# Altium schematic sheet COMM.SchDoc
size 594 x 420 mm; SheetNumber: 3; SheetTotal: 4
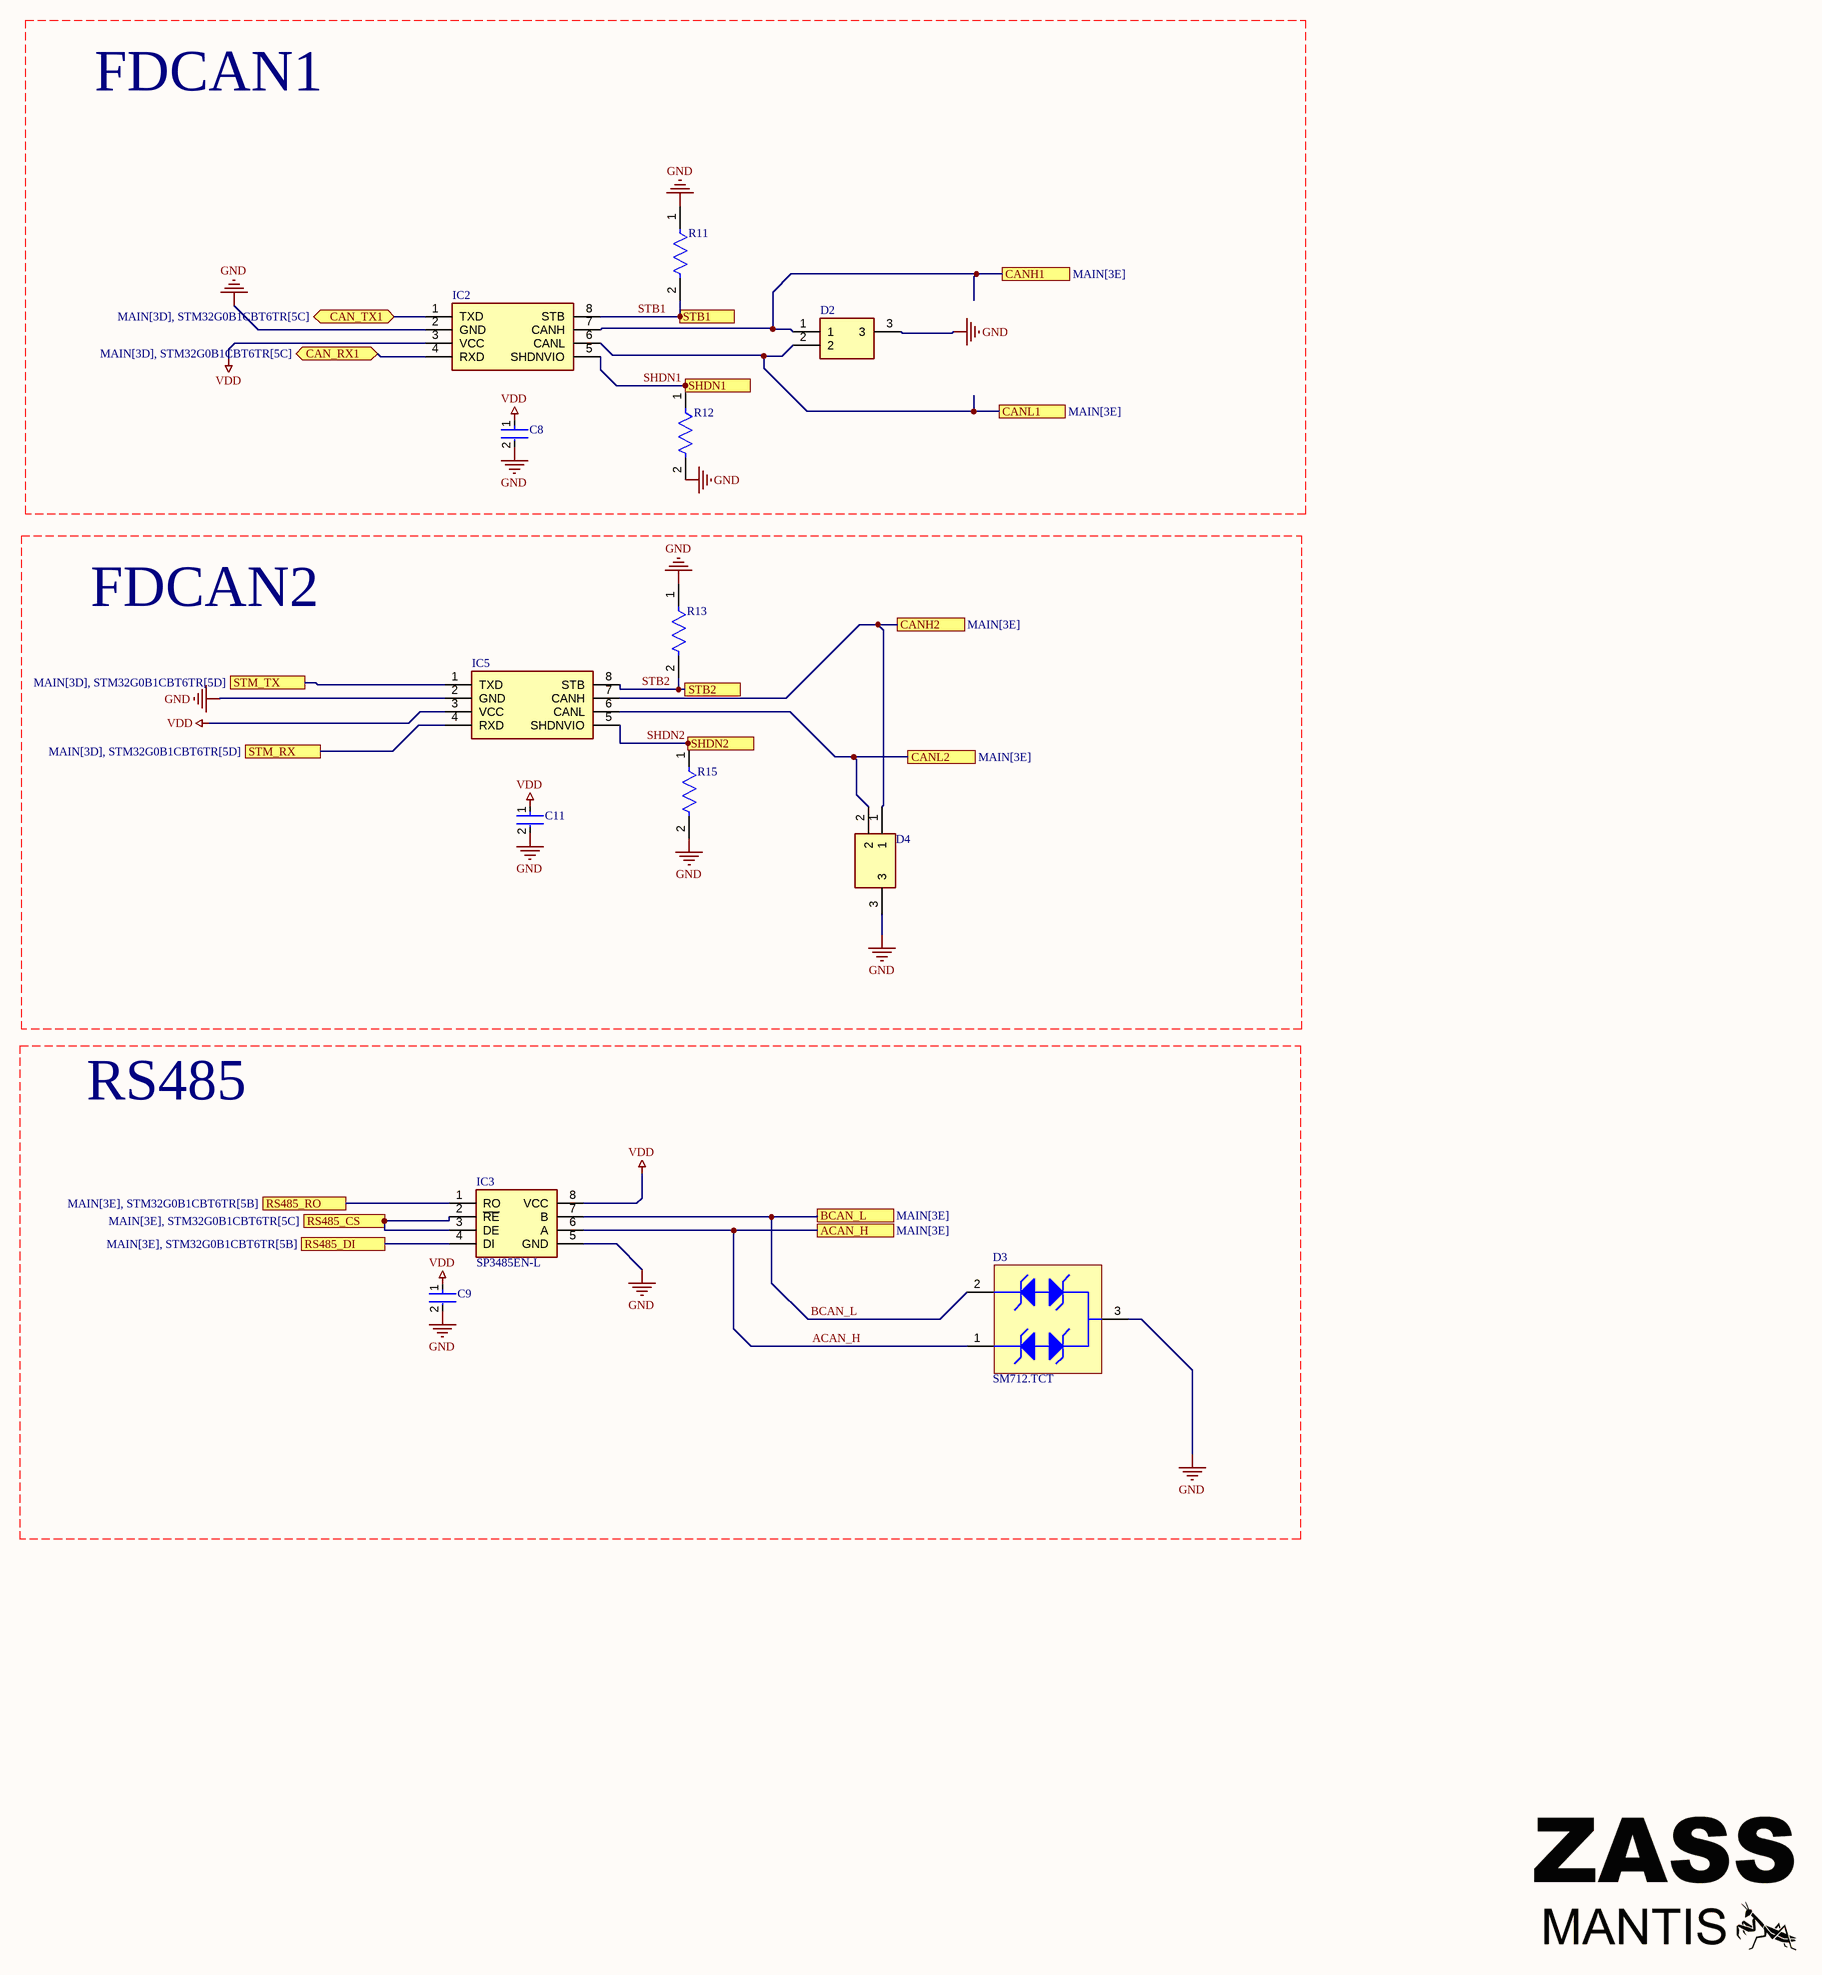
[diagram p0: COMM.SchDoc]

## Parts
C8  CC0805KRX7R5BB104  [FP-CC0805-EA-MFG]  (value not drawn)
C9  CC0805KRX7R5BB104  [FP-CC0805-EA-MFG]  (value not drawn)
C11  CC0805KRX7R5BB104  [FP-CC0805-EA-MFG]  (value not drawn)
D2  ESDCAN06-2BWY  [SOT65P210X110-3N]  (value not drawn)
D3  SM712.TCT  [SMTC-SOT23-3_V]
D4  ESDCAN06-2BWY  [SOT65P210X110-3N]  (value not drawn)
IC2  TCAN3414DR  [SOIC127P600X175-8N]  (value not drawn)
IC3  SP3485EN-L  [SOIC127P600X175-8N]
IC5  TCAN3414DR  [SOIC127P600X175-8N]  (value not drawn)
R11  CRGCQ0603J10K  [FP-CRGCQ0603-IPC_C]  (value not drawn)
R12  CRGCQ0603J10K  [FP-CRGCQ0603-IPC_C]  (value not drawn)
R13  CRGCQ0603J10K  [FP-CRGCQ0603-IPC_C]  (value not drawn)
R15  CRGCQ0603J10K  [FP-CRGCQ0603-IPC_C]  (value not drawn)

## Ports
ACAN_H (see MAIN[3E]), BCAN_L (see MAIN[3E]), CAN_RX1 (bidir, see MAIN[3D], STM32G0B1CBT6TR[5C]), CAN_TX1 (bidir, see MAIN[3D], STM32G0B1CBT6TR[5C]), CANH1 (see MAIN[3E]), CANH2 (see MAIN[3E]), CANL1 (see MAIN[3E]), CANL2 (see MAIN[3E]), RS485_CS (see MAIN[3E], STM32G0B1CBT6TR[5C]), RS485_DI (see MAIN[3E], STM32G0B1CBT6TR[5B]), RS485_RO (see MAIN[3E], STM32G0B1CBT6TR[5B]), SHDN1 (see MAIN[2D], STM32G0B1CBT6TR[5C]), SHDN2 (see MAIN[2D], STM32G0B1CBT6TR[5C]), STB1 (see MAIN[2D], STM32G0B1CBT6TR[5C]), STB2 (see MAIN[2D], STM32G0B1CBT6TR[5C]), STM_RX (see MAIN[3D], STM32G0B1CBT6TR[5D]), STM_TX (see MAIN[3D], STM32G0B1CBT6TR[5D])

## Nets
GND: C8.2 C9.2 C11.2 D2.3 D3.3 D4.3 IC2.2(GND) IC3.5(GND) IC5.2(GND) R11.1 R12.2 R13.1 R15.2
VDD: C8.1 C9.1 C11.1 IC2.3(VCC) IC3.8(VCC) IC5.3(VCC)
ACAN_H: D3.1 IC3.6(A) ; port ACAN_H
BCAN_L: D3.2 IC3.7(B) ; port BCAN_L
CAN_RX1: IC2.4(RXD) ; port CAN_RX1
CAN_TX1: IC2.1(TXD) ; port CAN_TX1
CANH1: D2.1 IC2.7(CANH) ; port CANH1
CANH2: D4.1 IC5.7(CANH) ; port CANH2
CANL1: D2.2 IC2.6(CANL) ; port CANL1
CANL2: D4.2 IC5.6(CANL) ; port CANL2
RS485_CS: IC3.2(~{RE}) IC3.3(DE) ; port RS485_CS
RS485_DI: IC3.4(DI) ; port RS485_DI
RS485_RO: IC3.1(RO) ; port RS485_RO
SHDN1: IC2.5(SHDNVIO) R12.1 ; port SHDN1
SHDN2: IC5.5(SHDNVIO) R15.1 ; port SHDN2
STB1: IC2.8(STB) R11.2 ; port STB1
STB2: IC5.8(STB) R13.2 ; port STB2
STM_RX: IC5.4(RXD) ; port STM_RX
STM_TX: IC5.1(TXD) ; port STM_TX

## Notes on the sheet
- FDCAN1
- FDCAN2
- RS485
- DWG NO:
- REV:
- THIS DOCUMENT AND THE DATA DISCLOSED HEREIN OR
- HEREWITH IS THE PROPERTY OF ALTIUM LIMITED AND MAY
- BE FREELY DISTRIBUTED IN WHOLE. NO RIGHTS ARE
- RESERVED OR EXPRESS OR IMPLIED WARANTEE GIVEN.
- REVISION
- DESCRIPTION
- DATE
- APPROVED
- PROJECT
- PROJECT REVISION:
- TITLE
- A2
- SIZE
- FILE NAME
- SHEET
- OF

## Library data of the parts
C8 C9 C11 = CMP-03422-000810-2: CAP CER X7R 0805; RoHS Compliant: Yes
D2 D4 = ESDCAN06-2BWY: TVS Diode (Bi-directional); Manufacturer_Name: STMicroelectronics; Datasheet Link: https://www.st.com/resource/en/datasheet/esdcan03-2bwy.pdf; Height: 1.1mm; Manufacturer_Part_Number: ESDCAN06-2BWY; Mouser Part Number: 511-ESDCAN06-2BWY; Mouser Price/Stock: https://www.mouser.co.uk/ProductDetail/STMicroelectronics/ESDCAN06-2BWY?qs=u4fy%2FsgLU9P2WkvcJBEfoQ%3D%3D; Arrow Part Number: ESDCAN06-2BWY; Arrow Price/Stock: https://www.arrow.com/en/products/esdcan06-2bwy/stmicroelectronics?utm_currency=USD&region=europe
D3 = CMP-2000-05357-1: Asymmetrical TVS Diode for Extended Common-Mode RS-485, 400 W, -55 to 125 degC, 3-Pin SOT23, RoHS, Tape and Reel; Manufacturer: Semtech; Configuration: Dual; Peak Pulse Power Dissipation: 400W; Product Length (mm): 2.9mm; Working Voltage: 12V/7V; Product Height (mm): 0.95mm; Direction Type: Bi-Directional; Product Depth (mm): 1.3mm; Reverse Breakdown Voltage: 13.3V; Reverse Stand-off Voltage: 12V; Leakage Current (Max): 0.02uA; Number of Elements: 2; Peak Pulse Current: 17A; Leakage Current: 1uA/20uA; Rad Hardened: No; Test Current (It): 1mA; Clamping Voltage: 26V/12V; Datasheet URL: https://datasheet.ciiva.com/18065/getdatasheetpartid-110620-18065348.pdf; Operating Temperature Classification: Military; Operating Temperature Min Deg. C: -55C; Manufacturer URL: http://www.semtech.com/; Package Reference: SOT23-3; Operating Temp Range: -55Cto125C; Mounting Style: SurfaceMount; Polarity: Bi-Directional; Pin Count: 3; Package Description: 3-Pin Small Outline Transistor, Body 2.9 x 1.3 mm, Pitch 0.95 mm; Datasheet Version: Nov-04; Mounting: SurfaceMount; Suppressor Type: TVS; Packaging: TapeandReel; Package / Case: SOT-23; Operating Temperature Max Deg. C: 125C
IC2 IC5 = TCAN3414DR: Integrated Circuit; Manufacturer_Name: Texas Instruments; Datasheet Link: https://www.ti.com/lit/ds/symlink/tcan3414.pdf?ts=1713723144569&ref_url=https%253A%252F%252Fwww.mouser.ch%252F; Height: 1.75mm; Manufacturer_Part_Number: TCAN3414DR; Mouser Part Number: 595-TCAN3414DR; Mouser Price/Stock: https://www.mouser.co.uk/ProductDetail/Texas-Instruments/TCAN3414DR?qs=mELouGlnn3egF2AojRJddw%3D%3D; Arrow Part Number: TCAN3414DR; Arrow Price/Stock: https://www.arrow.com/en/products/tcan3414dr/texas-instruments?utm_currency=USD&region=nac
IC3 = SP3485EN-L: Integrated Circuit; Manufacturer_Name: EXAR; Datasheet Link: https://datasheet.datasheetarchive.com/originals/distributors/Datasheets-DGA14/1190127.pdf; Height: 1.75mm; Manufacturer_Part_Number: SP3485EN-L; Mouser Part Number: 701-SP3485EN-L; Mouser Price/Stock: https://www.mouser.com/Search/Refine.aspx?Keyword=701-SP3485EN-L; Arrow Part Number: SP3485EN-L; Arrow Price/Stock: https://www.arrow.com/en/products/sp3485en-l/exar
R11-R13 R15 = CMP-03211-009884-1: CRGCQ 0603 10K 5%; Manufacturer: TE Connectivity; Tolerance: 0.05; Power Rating: 0.1W; Resistance: 10KΩ; Voltage Rating: 75V; Value: 10KΩ; Temperature Coefficient: ±100ppm/°C; Composition: Thick Film; ComponentLink2URL: https://www.te.com/commerce/DocumentDelivery/DDEController?Action=showdoc&DocId=Data+Sheet%7F1773204-3%7F1%7Fpdf%7FEnglish%7FENG_DS_1773204-3_1.pdf%7F4-2176339-923; Device Class L1: Passive Components; Package: CRGCQ0603; Mouser Description: Res Thick Film 0603 10K Ohm 5% 0.1W(1/10W) ±100ppm/C Pad SMD Automotive T/R; Temperature Range High: +155°C; Category: Res; Device Class L2: Resistors; Height: 0.55mm; RoHS: TRUE; Lead Free: Yes; Ipc Land Pattern Name: RESC16080X45; Temperature: -55°C to +155°C; Series: CRGCQ; Digikey Description: CRGCQ 0603 10K 5%; Octopart: https://octopart.com/crgcq0603j10k-te+connectivity-91018097; Device Class L3: Chip SMD Resistors; Ambient Temperature Range High: +70°C; ComponentLink2Description: Datasheet; Temperature Range Low: -55°C; Manufacturer Part Number: CRGCQ0603J10K